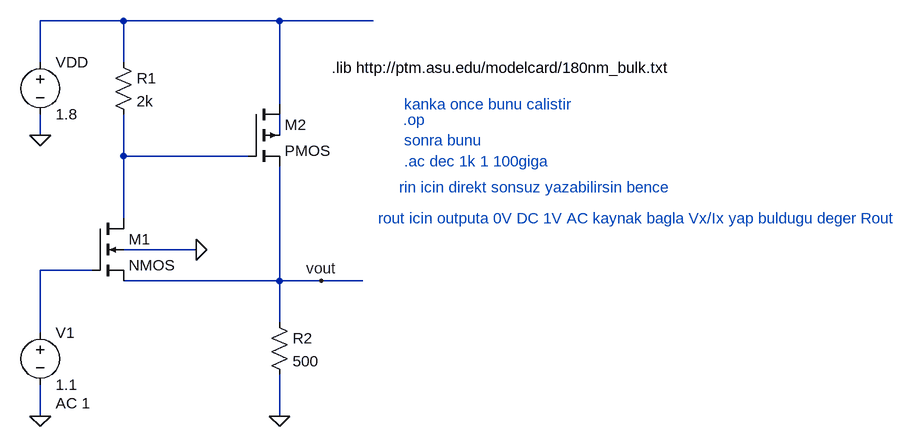
[diagram p0: schematic q4.asc]
q4.asc, the LTspice schematic file:
Version 4
SHEET 1 1232 728
WIRE -32 80 -160 80
WIRE 208 80 -32 80
WIRE 352 80 208 80
WIRE -160 144 -160 80
WIRE -32 144 -32 80
WIRE 208 208 208 80
WIRE -160 256 -160 224
WIRE 208 256 208 224
WIRE -32 288 -32 224
WIRE 160 288 -32 288
WIRE -32 384 -32 288
WIRE 80 432 -32 432
WIRE -80 464 -160 464
WIRE 208 480 208 304
WIRE 208 480 -32 480
WIRE 272 480 208 480
WIRE 336 480 272 480
WIRE 208 544 208 480
WIRE -160 560 -160 464
WIRE -160 688 -160 640
WIRE 208 688 208 624
FLAG 208 688 0
FLAG 80 432 0
FLAG -160 256 0
FLAG -160 688 0
FLAG 272 480 vout
SYMBOL res -48 128 R0
SYMATTR InstName R1
SYMATTR Value 2k
SYMBOL pmos4 160 208 R0
SYMATTR InstName M2
SYMATTR Value2 l=0.18u w=25u
SYMBOL nmos4 -80 384 R0
SYMATTR InstName M1
SYMATTR Value2 l=0.18u w=25u
SYMBOL res 192 528 R0
SYMATTR InstName R2
SYMATTR Value 500
SYMBOL voltage -160 128 R0
SYMATTR InstName VDD
SYMATTR Value 1.8
SYMBOL voltage -160 544 R0
WINDOW 123 24 124 Left 2
WINDOW 39 0 0 Left 0
SYMATTR InstName V1
SYMATTR Value 1.1
SYMATTR Value2 AC 1
TEXT 288 152 Left 2 !.lib http://ptm.asu.edu/modelcard/180nm_bulk.txt
TEXT 398 232 Left 2 ;.op
TEXT 400 208 Left 2 ;kanka once bunu calistir
TEXT 400 264 Left 2 ;sonra bunu
TEXT 400 296 Left 2 ;.ac dec 1k 1 100giga
TEXT 392 336 Left 2 ;rin icin direkt sonsuz yazabilirsin bence
TEXT 360 384 Left 2 ;rout icin outputa 0V DC 1V AC kaynak bagla Vx/Ix yap buldugu deger Rout

The netlist it stands for:
* q4.asc
R1 N001 N003 2k
M2 N001 N003 vout N002 PMOS l=0.18u w=25u
M1 N003 N004 vout 0 NMOS l=0.18u w=25u
R2 vout 0 500
VDD N001 0 1.8
V1 N004 0 1.1 AC 1
.model NMOS NMOS
.model PMOS PMOS
.lib standard.mos
.lib http://ptm.asu.edu/modelcard/180nm_bulk.txt
* .op
* kanka once bunu calistir
* sonra bunu
* .ac dec 1k 1 100giga
* rin icin direkt sonsuz yazabilirsin bence
* rout icin outputa 0V DC 1V AC kaynak bagla Vx/Ix yap buldugu deger Rout
.backanno
.end